# Altium schematic sheet mixer.SchDoc: Mixer + post-mixer amplifier
size A4; Engineer: CT; SheetNumber: 1; SheetTotal: 1
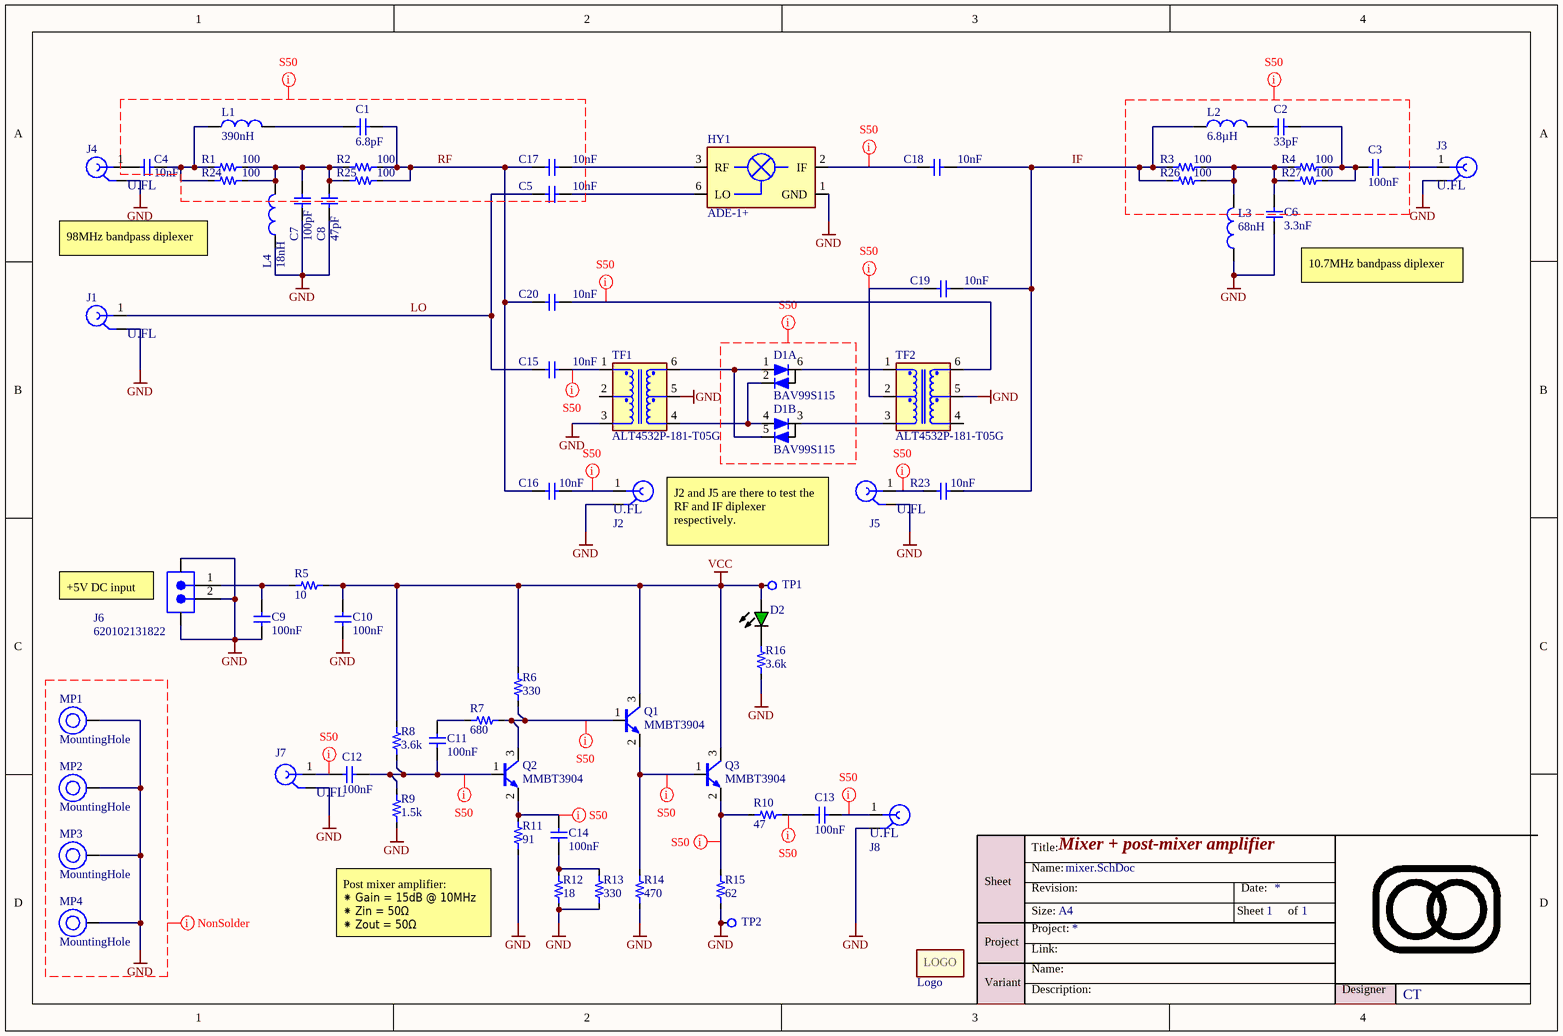
[diagram p0: mixer.SchDoc]

## Parts
C1  value 6.8pF  [0603-C-N]  (hidden comment: Capacitor 6.8pF +/-0.5pF 50V NP0 0603)
C2  value 33pF  [0603-C-N]  (hidden comment: Capacitor 33pF +/-1% 50V NP0 0603)
C3  value 100nF  [0603-C-N]  (hidden comment: Capacitor 100nF +/-10% 50V X7R 0603)
C4  value 10nF  [0603-C-N]  (hidden comment: Capacitor 10nF 50V NP0 0603)
C5  value 10nF  [0603-C-N]  (hidden comment: Capacitor 10nF 50V NP0 0603)
C6  value 3.3nF  [0603-C-N]  (hidden comment: Capacitor 3.3nF +/-10% 50V X7R 0603)
C7  value 100pF  [0603-C-N]  (hidden comment: Capacitor 100pF +/-5% 50V NP0 0603)
C8  value 47pF  [0603-C-N]  (hidden comment: Capacitor 47pF +/-5% 50V C0G 0603)
C9  value 100nF  [0603-C-N]  (hidden comment: Capacitor 100nF +/-10% 50V X7R 0603)
C10  value 100nF  [0603-C-N]  (hidden comment: Capacitor 100nF +/-10% 50V X7R 0603)
C11  value 100nF  [0603-C-N]  (hidden comment: Capacitor 100nF +/-10% 50V X7R 0603)
C12  value 100nF  [0603-C-N]  (hidden comment: Capacitor 100nF +/-10% 50V X7R 0603)
C13  value 100nF  [0603-C-N]  (hidden comment: Capacitor 100nF +/-10% 50V X7R 0603)
C14  value 100nF  [0603-C-N]  (hidden comment: Capacitor 100nF +/-10% 50V X7R 0603)
C15  value 10nF  [0603-C-N]  (hidden comment: Capacitor 10nF 50V NP0 0603)
C16  value 10nF  [0603-C-N]  (hidden comment: Capacitor 10nF 50V NP0 0603)
C17  value 10nF  [0603-C-N]  (hidden comment: Capacitor 10nF 50V NP0 0603)
C18  value 10nF  [0603-C-N]  (hidden comment: Capacitor 10nF 50V NP0 0603)
C19  value 10nF  [0603-C-N]  (hidden comment: Capacitor 10nF 50V NP0 0603)
C20  value 10nF  [0603-C-N]  (hidden comment: Capacitor 10nF 50V NP0 0603)
D1  BAV99S115  [SOT-363-N]  (parts A,B of 2)
D2  150060GS84000  [WL-SMCW_0603_150060xx8x000]  (value not drawn)
GR1  Logo  [LOGO_9x6mm]  (no BOM)
HY1  ADE-1+  [ADE-1+]
J1  U.FL-R-SMT(10)  [HRS-U.FL-R-SMT_V]  (value not drawn)
J2  U.FL-R-SMT(10)  [HRS-U.FL-R-SMT_V]  (value not drawn)
J3  U.FL-R-SMT(10)  [HRS-U.FL-R-SMT_V]  (value not drawn)
J4  U.FL-R-SMT(10)  [HRS-U.FL-R-SMT_V]  (value not drawn)
J5  U.FL-R-SMT(10)  [HRS-U.FL-R-SMT_V]  (value not drawn)
J6  620102131822  [620102131822]
J7  U.FL-R-SMT(10)  [HRS-U.FL-R-SMT_V]  (value not drawn)
J8  U.FL-R-SMT(10)  [HRS-U.FL-R-SMT_V]  (value not drawn)
L1  Inductance: 390nH  [WE-KI_1008]  (hidden comment: 744762239GA)
L2  Inductance: 6.8µH  [WE-RFH_1008A]  (hidden comment: 744758368A)
L3  Inductance: 68nH  [WE-KI_1008]  (hidden comment: 744762168GA)
L4  Inductance: 18nH  [WE-KI_1008]  (hidden comment: 744762118A)
MP1  MountingHole  [PTH-M3D6.5_VIA-RING]  (no BOM)
MP2  MountingHole  [PTH-M3D6.5_VIA-RING]  (no BOM)
MP3  MountingHole  [PTH-M3D6.5_VIA-RING]  (no BOM)
MP4  MountingHole  [PTH-M3D6.5_VIA-RING]  (no BOM)
Q1  MMBT3904  [SOT-23-3-N]
Q2  MMBT3904  [SOT-23-3-N]
Q3  MMBT3904  [SOT-23-3-N]
R1  value 100  [0603-R-N]  (hidden comment: Resistor 100R +/-1% 50V 0603)
R2  value 100  [0603-R-N]  (hidden comment: Resistor 100R +/-1% 50V 0603)
R3  value 100  [0603-R-N]  (hidden comment: Resistor 100R +/-1% 50V 0603)
R4  value 100  [0603-R-N]  (hidden comment: Resistor 100R +/-1% 50V 0603)
R5  value 10  [0603-R-N]  (hidden comment: Resistor 10R +/-1% 50V 0603)
R6  value 330  [0603-R-N]  (hidden comment: Resistor 330R +/-1% 50V 0603)
R7  value 680  [0603-R-N]  (hidden comment: Resistor 680R +/-1% 0.1W 0603)
R8  value 3.6k  [0603-R-N]  (hidden comment: Resistor 3.6k +/-0.1W 1% 0603)
R9  value 1.5k  [0603-R-N]  (hidden comment: Resistor 1.5k +/-1% 50V 0603)
R10  value 47  [0603-R-N]  (hidden comment: Resistor 47R +/-1% 0.1W 0603)
R11  value 91  [0603-R-N]  (hidden comment: Resistor 91R +/-1% 0.1W 0603)
R12  value 18  [0603-R-N]  (hidden comment: Resistor 18R +/-1% 0.1W 0603)
R13  value 330  [0603-R-N]  (hidden comment: Resistor 330R +/-1% 50V 0603)
R14  value 470  [0603-R-N]  (hidden comment: Resistor 470R +/-1% 50V 0603)
R15  value 62  [0603-R-N]  (hidden comment: Resistor 62R +/-1% 0.1W 0603)
R16  value 3.6k  [0603-R-N]  (hidden comment: Resistor 3.6k +/-0.1W 1% 0603)
R23  value 10nF  [0603-C-N]  (hidden comment: Capacitor 10nF 50V NP0 0603)
R24  value 100  [0603-R-N]  (hidden comment: Resistor 100R +/-1% 50V 0603)
R25  value 100  [0603-R-N]  (hidden comment: Resistor 100R +/-1% 50V 0603)
R26  value 100  [0603-R-N]  (hidden comment: Resistor 100R +/-1% 50V 0603)
R27  value 100  [0603-R-N]  (hidden comment: Resistor 100R +/-1% 50V 0603)
TF1  ALT4532P-181-T05G  [TF_STD_LAN1000_4532_6P]
TF2  ALT4532P-181-T05G  [TF_STD_LAN1000_4532_6P]
TP1  Testpad with multiple sizes  [TP_1.5mm_0.3mmHole]  (value not drawn)  (no BOM)
TP2  Testpad with multiple sizes  [TP_1.5mm_0.3mmHole]  (value not drawn)  (no BOM)

## Nets
GND: C6.1 C7.1 C8.1 C9.1 C10.1 HY1.1(GND) J1.2(GND) J2.2(GND) J3.2(GND) J4.2(GND) J5.2(GND) J6.2 J6.MP1 J6.MP2 J7.2(GND) J8.2(GND) L3.1 L4.1 MP1.1(H1) MP2.1(H1) MP3.1(H1) MP4.1(H1) R9.1 R11.1 R12.1 R13.1 R14.1 R15.1 R16.1 TF1.3(Sec1+) TF1.5(Sec1-) TF2.5(Sec1-) TP2.1(Pad)
VCC: C10.2 D2.2(A) Q1.3(C) Q3.3(C) R5.2 R6.2 R8.2 TP1.1(Pad)
IF: C18.2 C19.2 L2.1 R3.1 R23.2 R26.1
LO: C5.1 C15.1 J1.1(SIG)
RF: C1.2 C16.1 C17.1 C20.1 R2.2 R25.2
NetC1_1: C1.1 L1.2
NetC2_1: C2.1 L2.2
NetC2_2: C2.2 C3.2 R4.2 R27.2
NetC3_1: C3.1 J3.1(SIG)
NetC4_1: C4.1 J4.1(SIG)
NetC4_2: C4.2 L1.1 R1.1 R24.1
NetC5_2: C5.2 HY1.6(LO)
NetC6_2: C6.2 L3.2 R3.2 R4.1 R26.2 R27.1
NetC7_2: C7.2 C8.2 L4.2 R1.2 R2.1 R24.2 R25.1
NetC9_2: C9.2 J6.1 R5.1
NetC11_1: C11.1 R7.1
NetC11_2: C11.2 C12.1 Q2.1(B) R8.1 R9.2
NetC12_2: C12.2 J7.1(SIG)
NetC13_1: C13.1 R10.2
NetC13_2: C13.2 J8.1(SIG)
NetC14_1: C14.1 Q2.2(E) R11.2
NetC14_2: C14.2 R12.2 R13.2
NetC15_2: C15.2 TF1.1(Pri1+)
NetC16_2: C16.2 J2.1(SIG)
NetC17_2: C17.2 HY1.3(RF)
NetC18_1: C18.1 HY1.2(IF)
NetC19_1: C19.1 TF2.2(Pri2+)
NetC20_2: C20.2 TF2.6(Pri1-)
NetD1_1: D1.1(A) D1.5(C) TF1.6(Pri1-)
NetD1_2: D1.2(C) D1.4(A) TF1.4(Pri2-)
NetD1_3: D1.3(CA) TF2.3(Sec1+)
NetD1_6: D1.6(CA) TF2.1(Pri1+)
NetD2_1: D2.1(K) R16.2
NetJ5_1: J5.1(SIG) R23.1
NetQ1_1: Q1.1(B) Q2.3(C) R6.1 R7.2
NetQ1_2: Q1.2(E) Q3.1(B) R14.2
NetQ3_2: Q3.2(E) R10.1 R15.2

Not connected (* = marked no-connect by the designer): TF1 2(Pri2+); TF2 4(Pri2-)

## Layout directives
net class S50: (no net found under the mark), NetC11_2, NetC12_2, NetC13_1, NetC13_2, NetC14_1, NetC15_2, NetC16_2, NetC18_1, NetC19_1, NetC20_2, NetJ5_1, NetQ1_1, NetQ1_2, NetQ3_2, RF
CompClassName: NonSolder: GND

## Notes on the sheet
- 98MHz bandpass diplexer
- (near C6) 10.7MHz bandpass diplexer
- J2 and J5 are there to test the RF and IF diplexer respectively.
- (near J6) +5V DC input
- Post mixer amplifier:
  ⁕ Gain = 15dB @ 10MHz
  ⁕ Zin = 50Ω
  ⁕ Zout = 50Ω
- Title:
- Sheet
- Size:
- Name:
- Revision:
- A4
- Date:
- of
- Project
- Variant
- Project:
- Link:
- Description:
- Designer
- (in symbol Logo) LOGO

## Library data of the parts
C1 = CMP-072-000121-14: WCAP-CSGP Multilayer Ceramic Chip Capacitor, General Purpose, size 0603, NP0, 6.8pF, 50VDC; Capacitor Type: MLCC; Q Factor: 536; Insulation Resistance: 10GO; Technical Reference: NP006036R8D050DFCT10000; Tolerance: 0.5pF; Packaging: Tape and Reel; Case/Package: 0603; ComponentLink2Description: Datasheet Link; Match Code: WCAP-CSGP; ComponentLink2URL: https://www.we-online.com/redexpert/spec/885012006050?ad; Max Operating Temperature: 125°C; ComponentLink1URL: https://www.we-online.com/redexpert/article/885012006050?ad; Length: 1.6mm; Height: 0.8mm; Width: 0.8mm; Voltage Rating: 50V; Dielectric: NP0; Mounting Technology: SMT; ComponentLink1Description: Website Link; Usage: General Purpose; Pins: 2; Source: WCAP-CSGP.SchLib; Min Operating Temperature: -55°C; Design Item ID: 885012006050
C2 = CMP-001-00146-2: Multilayer Ceramic Capacitor 33 Pf 50 V ½ 1% C0G (NP0) 0603 [1608 Metric]; Page Part #: CCQF330; Dissipation Factor: 0.1%; Insulation Resistance: 10GR; Case Code (Imperial): 0603; Mounting Technology: Surface Mount; Max Operating Temperature: 125°C; Termination: SMD/SMT; RoHS Compliant: Yes; JLCPCB Part #: C519485; Voltage Rating: 50V; Lead Free: Lead Free; Depth: 0.8mm; Thickness: 0.035inch; Length: 1.6mm; Packaging: Tape and Reel; Min Operating Temperature: -55°C; Height: 0.8mm; Tolerance: 1%; Width: 0.8mm; Dielectric: C0G; Case/Package: 0603; Voltage Rating (DC): 50V; Halogen Free: Halogen Free; Radiation Hardening: No; Case Code (Metric): 1608; Series: CC
C3 C9-C14 = CMP-001-00017-24: Capacitor MLCC, General Purpose, size 0603, X7R, 100nF, +/-10%, 50V; Page Part #: CCQK104; Tolerance: 10%; Mounting Technology: SMT; Pins: 2; Max Operating Temperature: 125°C; Capacitor Type: MLCC; Dielectric: X7R; RoHS Compliant: True; Width: 0.8mm; Length: 1.6mm; Min Operating Temperature: -55°C; Usage: General Purpose; Height: 0.8mm; Case/Package: 0603; Voltage Rating: 50V; JLCPCB Part #: C14663
C4 C5 C15-C20 R23 = CMP-001-00137-6: Multilayer Ceramic Capacitor, Grm Series, 0.01 F, 5%, C0g / Np0, 50 V, 0603 [1608 Metric]; FLIR Part #: YCAM10N-7; Temperature Coefficient: 30ppm/°C; Voltage Rating (DC): 50V; Case Code (Metric): 1608; Voltage: 50V; Package Quantity: 4000; Depth: 0.8mm; Min Operating Temperature: -55°C; Lead Free: Lead Free; Lead Pitch: 0.5mm; Material: Ceramic; RoHS Compliant: Yes; Length: 1.6mm; Max Operating Temperature: 125°C; Thickness: 0.035inch; JLCPCB Part #: C85973; Voltage Rating: 50V; Reach SVHC Compliant: No; Tolerance: 5%; Termination: SMD/SMT; Width: 0.8mm; Dielectric: C0G; Case/Package: 0603; Case Code (Imperial): 0603; Height: 0.8mm; Series: GRM; Packaging: Cut Tape; Mounting Technology: Surface Mount
C6 = CMP-072-000609-13: WCAP-CSGP Multilayer Ceramic Chip Capacitor, General Purpose, size 0603, X7R, 3.3nF, 50VDC; Technical Reference: X7R0603332K050DFCT10000; Capacitor Type: MLCC; Tolerance: 10%; Dissipation Factor: 2.5%; Insulation Resistance: 10GO; ComponentLink1URL: https://www.we-online.com/redexpert/article/885012206086?ad; Packaging: Tape and Reel; Usage: General Purpose; Height: 0.8mm; ComponentLink2Description: Datasheet Link; Pins: 2; ComponentLink1Description: Website Link; ComponentLink2URL: https://www.we-online.com/redexpert/spec/885012206086?ad; Match Code: WCAP-CSGP; Voltage Rating: 50V; Design Item ID: 885012206086; Width: 0.8mm; Length: 1.6mm; Dielectric: X7R; Source: WCAP-CSGP.SchLib; Min Operating Temperature: -55°C; Case/Package: 0603; Max Operating Temperature: 125°C; Mounting Technology: SMT
C7 = CMP-072-000128-17: WCAP-CSGP Multilayer Ceramic Chip Capacitor, General Purpose, size 0603, NP0, 100pF, 50VDC; Page Part #: CCQJ101; Technical Reference: NP00603101J050DFCT10000; Tolerance: 5%; Insulation Resistance: 10GO; Capacitor Type: MLCC; Q Factor: 1000; Packaging: Tape and Reel; ComponentLink1Description: Website Link; Design Item ID: 885012006057; Match Code: WCAP-CSGP; ComponentLink2URL: https://www.we-online.com/redexpert/spec/885012006057?ad; Dielectric: NP0; Min Operating Temperature: -55°C; Max Operating Temperature: 125°C; Mounting Technology: SMT; Case/Package: 0603; ComponentLink1URL: https://www.we-online.com/redexpert/article/885012006057?ad; Source: WCAP-CSGP.SchLib; Voltage Rating: 50V; Width: 0.8mm; Pins: 2; JLCPCB Part #: C14858; ComponentLink2Description: Datasheet Link; Usage: General Purpose; Length: 1.6mm; Height: 0.8mm
C8 = CMP-001-00100-15: Capacitor MLCC, General Purpose, size 0603, C0G, 47pF, +/-5%, 50V; Tolerance: 5%; Temperature Coefficient: 30ppm/°C; Case/Package: 0603; REACH SVHC: Unknown; Length: 1.6mm; Voltage Rating: 50V; Height: 0.8mm; Packaging: Tape and Reel; Pins: 2; Mounting Technology: SMT; Usage: General Purpose; Dielectric: C0G; Capacitor Type: MLCC; JLCPCB Part #: C1671; RoHS Compliant: True; Max Operating Temperature: 125°C; Min Operating Temperature: -55°C; Width: 0.8mm
D1 = CMP-004-00059-1: Diode-gp Power Switching; Average Rectified Current: 200mA; Max Repetitive Reverse Voltage (Vrrm): 100V; Max Reverse Current: 500nA; Max Forward Surge Current (Ifsm): 4A; Reverse Recovery Time: 4ns; Voltage: 75V; Pins: 6; Case/Package: TSSOP; Package Quantity: 1; Lead Free: Lead Free; Reach SVHC Compliant: No; Forward Current: 200mA; Height: 1mm; JLCPCB Part #: C96225; Max Reverse Voltage (DC): 100V; Width: 1.35mm; Min Operating Temperature: -65°C; Max Operating Temperature: 150°C; Packaging: Cut Tape; Mounting Technology: Surface Mount; Length: 2.2mm
D2 = CMP-002-001076-16: WL-SMCW Mono-color Chip LED Waterclear, size 0603, Green, 3.3V, 40°; Manufacturer: Wurth Elektronik; Page Part #: MOVPA-0270A; Chip Technology: InGaN; Case/Size Code: 0603; Luminous Intensity: 3000mcd; Peak Wavelength: 520nm; Dominant Wavelength: 525nm; Mount: Surface Mount; Design Item ID: 150060GS84000; Category: Signal LEDs; Component Type: Standard; Emitting Color: Green; Viewing Angle: 40°; Height: 0.95mm; Width: 0.8mm; Length: 1.6mm; JLCPCB Part #: C7429914; Packaging: Tape and Reel; Match Code: WL-SMCW; ComponentLink2Description: Datasheet Link; Forward Voltage: 3.3V; ComponentLink1Description: Website Link; ComponentLink2URL: https://www.we-online.com/redexpert/spec/150060GS84000?ad; Source: WL-SMCW.SchLib; Operating Temperature Max: 85°C; Manufacturer Part Number: 150060GS84000; Pin Count: 2; Operating Temperature Min: -40°C; ComponentLink1URL: https://www.we-online.com/redexpert/article/150060GS84000?ad
HY1 = CMP-00025-00013-3: Double Balanced Mixer, 0.5MHz Min, 500MHz Max, 7.8dB Conversion Loss-Max; pin to pad: 1>1+4+5; RoHS Compliant: Yes; Min Operating Temperature: -40°C; Clock Frequency: 500MHz; Pins: 6; Reach SVHC Compliant: Yes; JLCPCB Part #: C2942210; Max Operating Temperature: 85°C; Mounting Technology: Surface Mount
J1-J5 J7 J8 = CMP-002-00035-12: Ultra Small Surface Mount Coaxial Connector, 50 Ohm, -40 to 90 degC, 3-Pin SMD, RoHS, Tape and Reel; pin to pad: 1>3 2>1+2; Manufacturer: Hirose Electric; Connector Type: RF&Coax; Impedance: 50Ohm; Value: U.FL; Case/Package: U.FL-R-SMT; Package Quantity: 2500; Packaging: TapeandReel; RoHS Compliant: True; Contact Material: Brass; Contact Plating: Gold; Min Operating Temperature: -40°C; JLCPCB Part #: C88373; Package Reference: U.FL-R-SMT; Datasheet Version: Aug-16; Manufacturer URL: https://www.hirose.com; Max Operating Temperature: 90°C; Fastening Type: Snap; Package Description: 3-Pin Surface Mount Device, Body 2.6 x 2.6 mm; Resistance: 50Ohm; Mounting Technology: SM; Datasheet URL: https://www.hirose.com/product/en/download_file/key_name/U.FL/category/Catalog/doc_file_id/31697/?file_category_id=4&item_id=15&is_series=1
J6 = CMP-047-000040-15: WR-WTB SMT Male Horizontal Shrouded Header, pitch 2mm, 2p; Page Part #: K620102131822; Pin Number: 2; Rated Current: 2A; Contact Resistance: 20mOhm; Value: JST-PH; Withstanding Voltage: 800VAC; Working Voltage: 100VAC; Source: WR-WTB_2.00mm.SchLib; Operating Temperature: -25 to +85degC; JLCPCB Part #: C295747; Pin Count: 2; Pitch: 2mm; Part Number: 620102131822; Component Type: Standard; Packaging: Tape and Reel; Type: Horizontal; Publisher: Wurth Elektronik; Gender: Male; ComponentLink2Description: Datasheet; ComponentLink1Description: Manufacturer; Mounting Technology: SMT; ComponentLink1URL: http://www.we-online.de; ComponentLink2URL: https://www.we-online.com/catalog/datasheet/620102131822.pdf; Published Date: January 2020; Design Item ID: 620102131822
L1 = CMP-051-000215-6: WE-KI SMT Wire Wound Ceramic Inductor, size 1008, 390nH, 0.47A; Manufacturer: Wurth Elektronik; DC Resistance Max: 1.06Ohm; Q Factor: 45; Inductance Tolerance: +/-2%; Case/Size Code: 1008; Self Resonant Frequency: 530MHz; Match Code: WE-KI; Category: RF Inductors; ComponentLink1URL: http://www.we-online.de; Height: 1.6mm; Packaging: Tape and Reel; Pin Count: 2; Length: 2.5mm; ComponentLink2Description: Datasheet; Width: 2mm; Manufacturer Part Number: 744762239GA; Mount: SMT; Component Type: Standard; Operating Temperature Min: -40°C; Source: WE-KI.SchLib; ComponentLink2URL: https://www.we-online.com/catalog/datasheet/744762239GA.pdf; Operating Temperature Max: 125°C; Design Item ID: 744762239GA; ComponentLink1Description: Manufacturer Link; Rated Current: 0.47A
L2 = CMP-003-000840-3: WE-RFH SMT Ferrite Inductor, size 1008A, 6.8µH, 0.36A, 2O; Manufacturer: Wurth Elektronik; Q Factor: 20; Inductance Tolerance: +/-5%; Self Resonant Frequency: 70MHz; Length: 2.6mm; Packaging: Tape and Reel; ComponentLink1Description: Website Link; DC Resistance Max: 2O; Operating Temperature Max: 85°C; Pin Count: 2; Rated Current: 0.36A; Mount: Surface Mount; ComponentLink2Description: Datasheet Link; ComponentLink2URL: https://www.we-online.com/redexpert/spec/744758368A?ad; Match Code: WE-RFH; Component Type: Standard; Case/Size Code: 1008A; Design Item ID: 744758368A; Height: 1.7mm; Operating Temperature Min: -40°C; Width: 2.1mm; Manufacturer Part Number: 744758368A; ComponentLink1URL: https://www.we-online.com/redexpert/article/744758368A?ad; Category: RF Inductors; Source: WE-RFH.SchLib
L3 = CMP-051-000197-6: WE-KI SMT Wire Wound Ceramic Inductor, size 1008, 68nH, 1A; Manufacturer: Wurth Elektronik; Inductance Tolerance: +/-2%; Case/Size Code: 1008; DC Resistance Max: 0.15Ohm; Q Factor: 60; Self Resonant Frequency: 1300MHz; Match Code: WE-KI; Category: RF Inductors; Length: 2.5mm; ComponentLink1URL: http://www.we-online.de; Pin Count: 2; ComponentLink2Description: Datasheet; Height: 1.6mm; Mount: SMT; Source: WE-KI.SchLib; Rated Current: 1A; Manufacturer Part Number: 744762168GA; Packaging: Tape and Reel; Component Type: Standard; ComponentLink2URL: https://www.we-online.com/catalog/datasheet/744762168GA.pdf; Design Item ID: 744762168GA; Operating Temperature Min: -40°C; ComponentLink1Description: Manufacturer Link; Width: 2mm; Operating Temperature Max: 125°C
L4 = CMP-051-000182-6: WE-KI SMT Wire Wound Ceramic Inductor, size 1008, 18nH, 1A; Manufacturer: Wurth Elektronik; Inductance Tolerance: +/-5%; Self Resonant Frequency: 2700MHz; DC Resistance Max: 0.1Ohm; Case/Size Code: 1008; Q Factor: 60; ComponentLink2Description: Datasheet; Height: 1.6mm; Operating Temperature Max: 125°C; ComponentLink1Description: Manufacturer Link; Operating Temperature Min: -40°C; Packaging: Tape and Reel; Mount: SMT; Component Type: Standard; ComponentLink2URL: https://www.we-online.com/catalog/datasheet/744762118A.pdf; Width: 2mm; Source: WE-KI.SchLib; Category: RF Inductors; Design Item ID: 744762118A; ComponentLink1URL: http://www.we-online.de; Manufacturer Part Number: 744762118A; Rated Current: 1A; Match Code: WE-KI; Pin Count: 2; Length: 2.5mm
MP1-MP4 = CMP-00028-00004-15: Mounting hole.  Add this so that mounting holes placed in your design don't automagically disappear when you import changes from the schematic.; Pins: 1
Q1-Q3 = CMP-014-00026-4: NPN General Purpose Amplifier, 40 V, 0.2 A, -55 to 150 degC, 3-Pin SOT23, RoHS, Tape and Reel; Manufacturer: Fairchild Semiconductor; Elements: 1; Frequency: 300MHz; hFE Min: 100; Vce Max: 300mV; Package Version: Rev. 12, 03/2016; Power: 625mW; Packaging: TapeandReel; Datasheet Version: Rev. 1.1.0, 10/2014; RoHS Compliant: True; Package Quantity: 3000; Pins: 3; Case/Package: TO-236-3; Package Reference: SOT23-3; Mounting Technology: SM; Package URL: http://www.fairchildsemi.com/dwg/MA/MA03D.pdf; Min Operating Temperature: -55°C; Datasheet URL: https://www.fairchildsemi.com/datasheets/MM/MMBT3904.pdf; Manufacturer URL: https://www.fairchildsemi.com/; Max Operating Temperature: 150°C; JLCPCB Part #: C20526; Package Description: 3-Pin Small Outline Transistor, Body 2.92 x 1.325 mm, Pitch 0.95 mm
R1-R4 R24-R27 = CMP-009-00232-17: Chip Resistor, Thick Film, General Purpose, 0603, 63mW, 50V, 100 Ohm, +/-1%; Temperature Coefficient: 100ppm/°C; Tolerance: 1%; Power Rating: 100mW; Elements: 1; Resistor Type: Thick Film; JLCPCB Part #: C22775; Voltage Rating: 50V; Case/Package: 0603; Min Operating Temperature: -55°C; Max Operating Temperature: 155°C; RoHS Compliant: Yes; Pins: 2; Usage: General Purpose; Mounting Technology: SMT
R5 = CMP-009-00230-18: Chip Resistor, Thick Film, General Purpose, 0603, 100mW, 50V, 10 Ohm, +/-1%; Tolerance: 1%; Elements: 1; Temperature Coefficient: 200ppm/°C; Pins: 2; Max Operating Temperature: 155°C; Mounting Technology: SMT; RoHS Compliant: Yes; JLCPCB Part #: C22859; Voltage Rating: 50V; Case/Package: 0603; Resistor Type: Thick Film; Min Operating Temperature: -55°C; Power Rating: 100mW; Usage: General Purpose
R6 R13 = CMP-009-00203-21: Chip Resistor, Thick Film, General Purpose, 0603, 100mW, 50V, 330 Ohm, +/-1%; Page Part #: ROQF3300; Tolerance: 1%; Elements: 1; Temperature Coefficient: 100ppm/°C; Usage: General Purpose; Resistor Type: Thick Film; JLCPCB Part #: C23138; Mounting Technology: SMT; Max Operating Temperature: 155°C; Pins: 2; Voltage Rating: 50V; Case/Package: 0603; Min Operating Temperature: -55°C; Power Rating: 100mW
R7 = CMP-009-00393-1: SMD Chip Resistor, 680 Ohm, ï¿½ 1%, 100 mW, 0603 [1608 Metric], Thick Film, Precision; Max Power Dissipation: 100mW; Temperature Coefficient: 100ppm/°C; Voltage Rating (DC): 75V; Number of Terminations: 2; Package Quantity: 1; Tolerance: 1%; Contact Plating: Tin; Series: ERJ; Resistor Type: Thick Film; Lead Free: Lead Free; Features: Automotive AEC-Q200; Packaging: Tape and Reel; Length: 1.6mm; Construction: Rectangular; Termination: SMD/SMT; Min Operating Temperature: -55°C; Voltage Rating: 75V; Width: 0.8mm; JLCPCB Part #: C23228; Case Code (Imperial): 0603; Max Operating Temperature: 155°C; Military Standard: Not; Case Code (Metric): 1608; RoHS Compliant: Yes; Case/Package: 0603; Pins: 2; Height: 0.022inch; Resistance Tolerance: 1%; Power Rating: 100mW; Mounting Technology: Surface Mount; Reach SVHC Compliant: No; Radiation Hardening: No; Depth: 0.8mm
R8 R16 = CMP-009-00405-1: Res Thick Film 0603 3.6K Ohm 1% 0.1W(1/10W) ±100ppm/°C Pad SMD T/R; RoHS Compliant: Yes; Case/Package: 0603; JLCPCB Part #: C22980; Lead Free: Lead Free
R9 = CMP-009-00201-21: Chip Resistor, Thick Film, General Purpose, 0603, 100mW, 50V, 1.5 kOhm, +/-1%; Tolerance: 1%; Elements: 1; Pins: 2; Max Operating Temperature: 155°C; Voltage Rating: 50V; JLCPCB Part #: C22843; RoHS Compliant: Yes; Min Operating Temperature: -55°C; Power Rating: 100mW; Case/Package: 0603; Resistor Type: Thick Film; Usage: General Purpose; Mounting Technology: SMT
R10 = CMP-009-00372-5: SMD Chip Resistor, 47 Ohm, ± 1%, 100 mW, 0603 [1608 Metric], Thick Film, General Purpose; Voltage Rating (DC): 50V; Power Rating: 100mW; Temperature Coefficient: 100ppm/°C; Voltage Rating: 75V; Weight: 7.1E-05oz; Case/Package: 0603; Features: Moisture Resistant; Packaging: Tape and Reel; Voltage Rating (AC): 50V; Height: 0.45mm; Max Operating Temperature: 155°C; JLCPCB Part #: C23182; Usage: General Purpose; Resistance Tolerance: 1%; Pins: 2; Military Standard: Not; Width: 0.8mm; RoHS Compliant: Yes; Reach SVHC Compliant: Unknown; Number of Terminations: 2; Construction: Rectangular; Case Code (Imperial): 0603; Lead Free: Lead Free; Depth: 0.8mm; Case Code (Metric): 1608; Series: RC; Termination: SMD/SMT; Tolerance: 1%; Min Operating Temperature: -55°C; Max Power Dissipation: 100mW; Resistor Type: Thick Film; Length: 1.6mm
R11 = CMP-009-00407-1: SMD Chip Resistor, 91 Ohm, ± 1%, 100 mW, 0603 [1608 Metric], Thick Film, General Purpose; Voltage Rating (DC): 50V; Temperature Coefficient: 100ppm/°C; Max Power Dissipation: 100mW; Construction: Rectangular; Max Operating Temperature: 155°C; Case Code (Metric): 1608; Depth: 0.8mm; Min Operating Temperature: -55°C; Height: 0.45mm; Length: 1.6mm; RoHS Compliant: Yes; Number of Terminations: 2; Case Code (Imperial): 0603; Lead Free: Lead Free; Tolerance: 1%; Features: Moisture Resistant; Power Rating: 100mW; Series: RC; Termination: SMD/SMT; Case/Package: 0603; Packaging: Tape and Reel; JLCPCB Part #: C2960792; Voltage Rating: 50V; Military Standard: Not; Width: 0.8mm
R12 = CMP-009-00408-1: SMD Chip Resistor, 18 ohm, ï¿½ 1%, 100 mW, 0603 [1608 Metric], Thick Film, General Purpose; Voltage Rating: 50V; Power Rating: 100mW; Temperature Coefficient: 100ppm/°C; Working Voltage: 75V; Military Standard: Not; Length: 1.6mm; Case Code (Imperial): 0603; Case/Package: 0603; Voltage Rating (AC): 50V; Reach SVHC Compliant: Unknown; Termination: SMD/SMT; Number of Terminations: 2; Tolerance: 1%; Series: RC; Max Power Dissipation: 100mW; Technology: THICK FILM; Max Operating Temperature: 155°C; Features: Moisture Resistant; Width: 0.8mm; Depth: 0.8mm; Packaging: Tape and Reel; Voltage Rating (DC): 50V; JLCPCB Part #: C2933165; Resistor Type: Thick Film; Resistance Tolerance: 1%; Height: 0.45mm; Construction: Rectangular; Lead Free: Lead Free; Pins: 2; Min Operating Temperature: -55°C; Case Code (Metric): 1608; RoHS Compliant: Yes; Package Quantity: 5000
R14 = CMP-009-00190-23: Chip Resistor, Thick Film, General Purpose, 0603, 100mW, 50V, 470 Ohm, +/-1%; Tolerance: 1%; Elements: 1; RoHS Compliant: Yes; Case/Package: 0603; JLCPCB Part #: C23179; Min Operating Temperature: -55°C; Usage: General Purpose; Pins: 2; Power Rating: 100mW; Max Operating Temperature: 155°C; Resistor Type: Thick Film; Mounting Technology: SMT; Voltage Rating: 50V
R15 = CMP-009-00411-1: Res Thick Film 0603 62 Ohm 1% 1/10W ±100ppm/°C Molded SMD SMD Paper T/R; Max Power Dissipation: 100mW; Features: Automotive AEC-Q200; Contact Plating: Tin,Matte; Case Code (Imperial): 0603; Mounting Technology: Surface Mount; Height: 0.022inch; Min Operating Temperature: -55°C; Width: 0.031inch; Case Code (Metric): 1608; Case/Package: 0603; Package Quantity: 5000; Number of Terminations: 2; Length: 0.061inch; Temperature Coefficient: 100ppm/°C; Radiation Hardening: No; Max Operating Temperature: 155°C; Packaging: Tape and Reel; JLCPCB Part #: C23222; RoHS Compliant: Yes; Series: RMCF; Tolerance: 1%; Ratings: AEC-Q200
TF1 TF2 = CMP-142-000004-8: Pulse Transformers and Modules for LAN, Transformer, LxWxH=4.5x3.2x2.9mm; pin to pad: 2>6 3>2 5>3 6>5; FLIR Part #: YTFM1000; Property 1: 100µH; Value: 180uH; Property 2: 8mA; Property 3: 1500Vrms; 3D_model: step; Turns Ratio: 1:1; Status: P; Pin Count: 6; Category: Transformer; Component Type: Standard; SubCategory: Signal; Cost: 0,2; Design Item ID: YTFM1000; Article: YTFM1000; JLCPCB Part #: C7501942; Source: BRD240510.SCHLIB; Packaging: Cut Tape; RoHS Compliant: Yes; Min Operating Temperature: -40°C; Series: ALT; Transformer Type: LAN; Mounting Technology: Surface Mount; Max Operating Temperature: 105°C
TP1 TP2 = CMP-027-000000-17: Testpad land; Design Item ID: Testpad; Component Type: Standard; Pin Count: 1